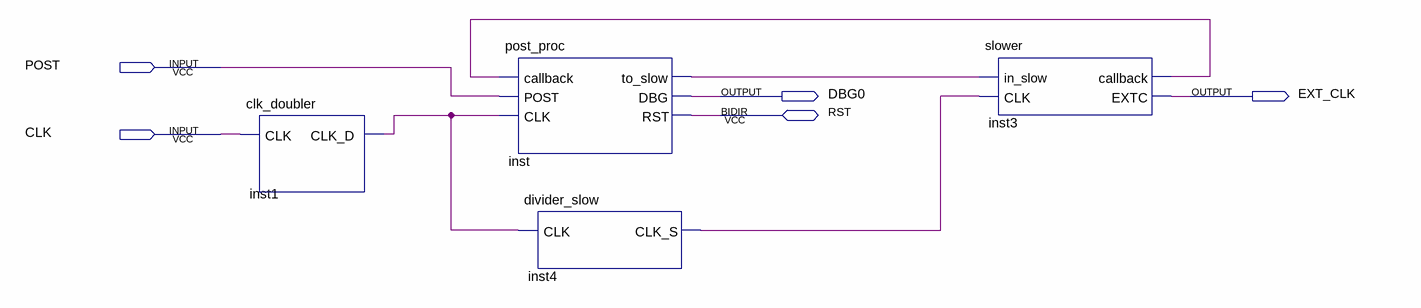
[diagram p0: schematic sheet]
// Quartus schematic main.bdf as structural Verilog: 4 symbols, 5 pins
module main (
  input  POST,
  input  CLK,
  inout  RST,
  output DBG0,
  output EXT_CLK
);

  wire inst1_clk_d, inst3_callback, inst4_clk_s, inst_to_slow;

  clk_doubler inst1 (.CLK(CLK), .CLK_D(inst1_clk_d));
  post_proc inst (
    .callback(inst3_callback), .POST(POST), .CLK(inst1_clk_d), .to_slow(inst_to_slow), .DBG(DBG0), .RST(RST));
  divider_slow inst4 (.CLK(inst1_clk_d), .CLK_S(inst4_clk_s));
  slower inst3 (.in_slow(inst_to_slow), .CLK(inst4_clk_s), .callback(inst3_callback), .EXTC(EXT_CLK));
endmodule
